# EAGLE design QuadController (EAGLE 6.0)
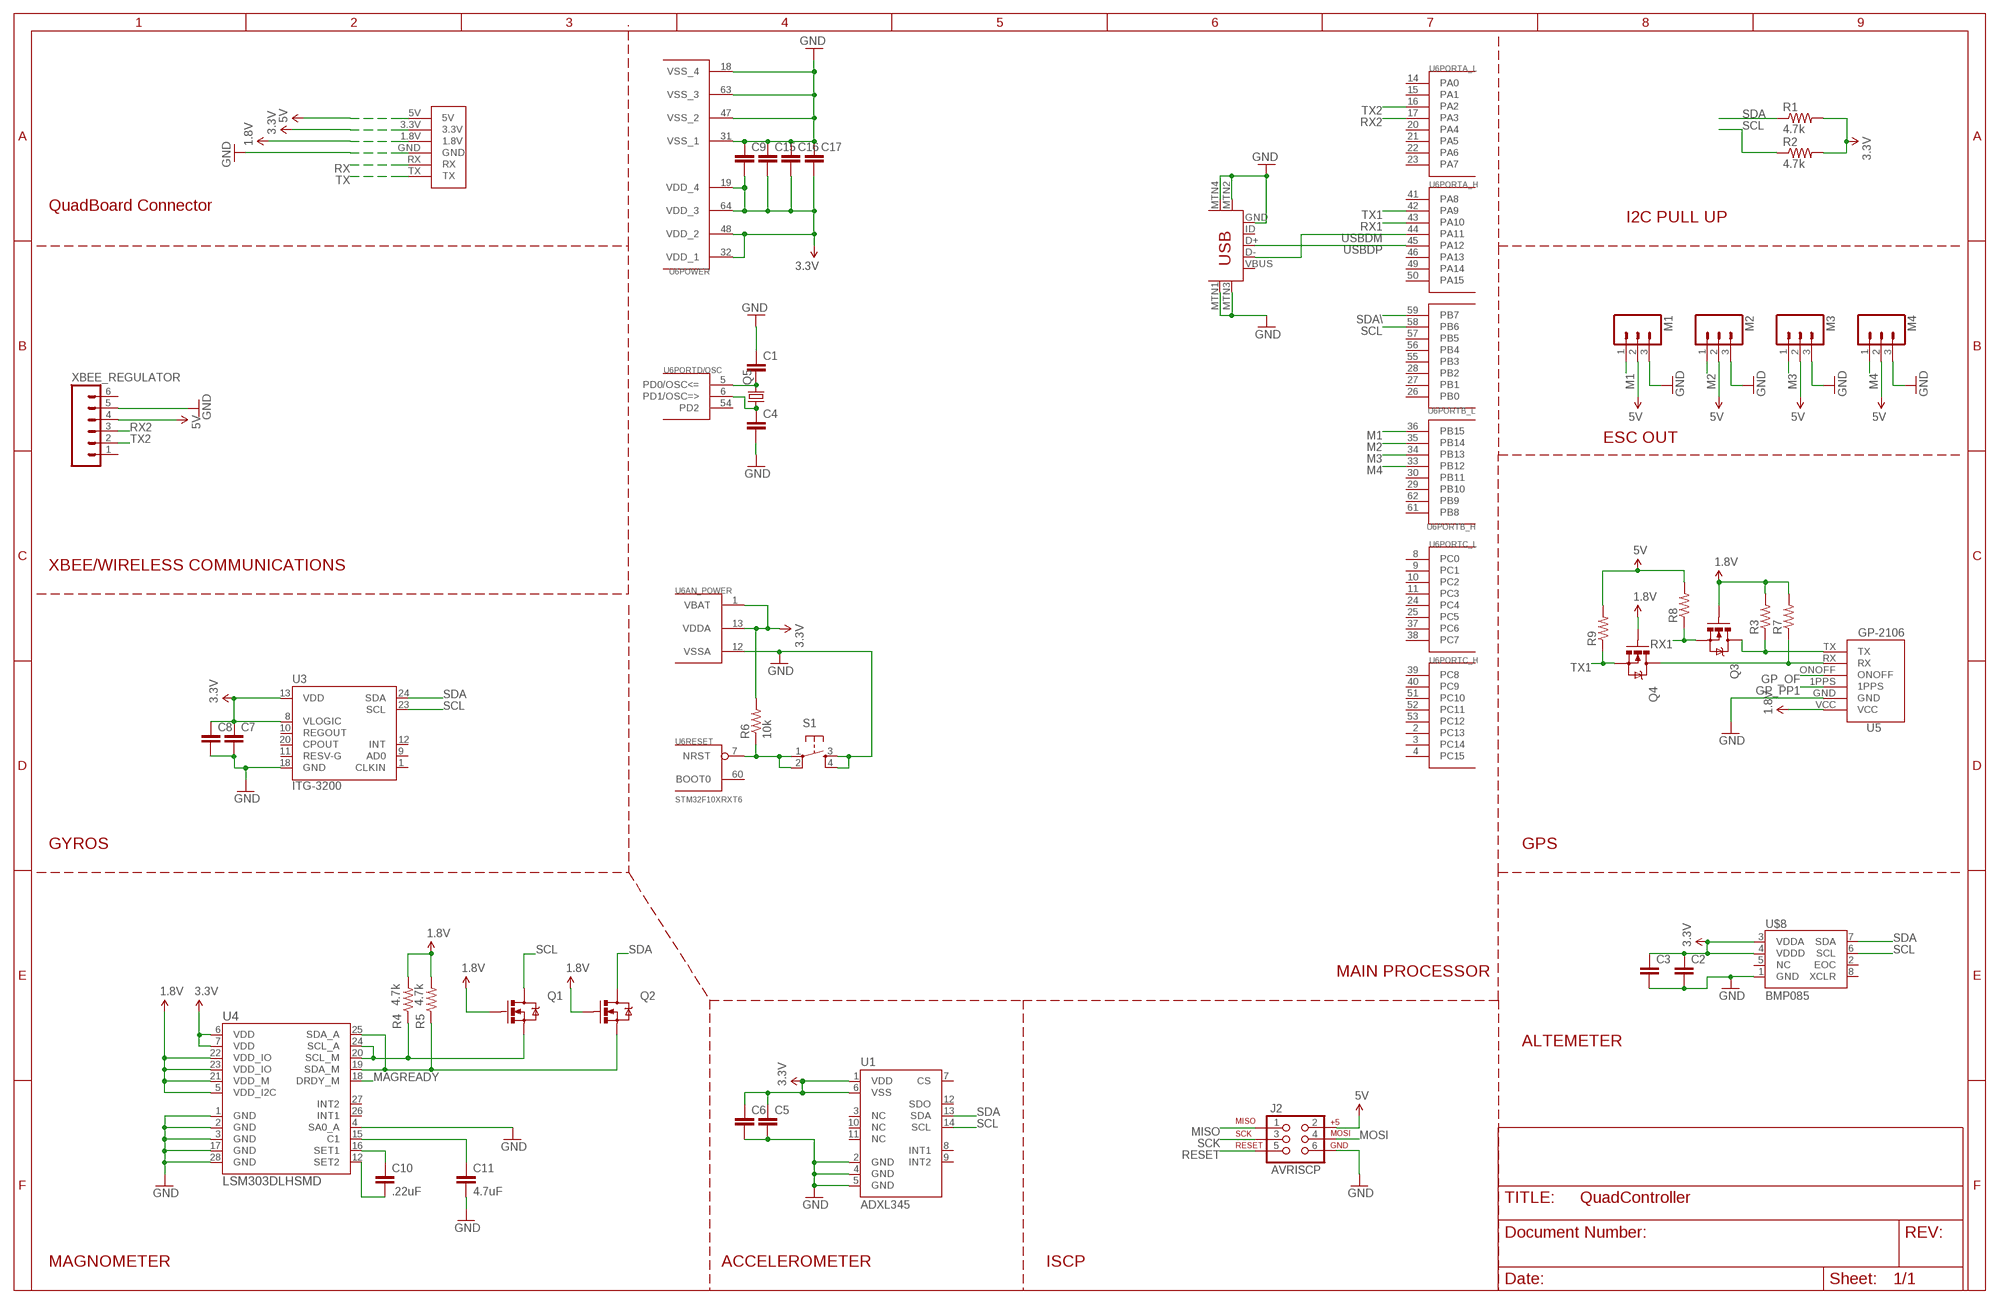
[diagram p0: schematic, sheet 1]

## Parts
C1  CAP0805  [0805]
C2  CAP0805  [0805]
C3  CAP0805  [0805]
C4  CAP0805  [0805]
C5  CAP0805  [0805]
C6  CAP0805  [0805]
C7  CAP0805  [0805]
C8  CAP0805  [0805]
C9  CAP0805  [0805]
C10  .22uF  CAP0805  [0805]
C11  4.7uF  CAP0805  [0805]
C15  CAP0805  [0805]
C16  CAP0805  [0805]
C17  CAP0805  [0805]
J2  AVRISCP  AVR_SPI_PRG_6PTH  [2X3]
M1  M03PTH  [1X03]
M2  M03PTH  [1X03]
M3  M03PTH  [1X03]
M4  M03PTH  [1X03]
Q1  MOSFET-NCHANNELSMD  [SOT23-3]
Q2  MOSFET-NCHANNELSMD  [SOT23-3]
Q3  MOSFET-NCHANNELSMD  [SOT23-3]
Q4  MOSFET-NCHANNELSMD  [SOT23-3]
Q5  CRYSTALHC49UP  [HC49UP]
QB1  QUADBOARD  [QUADBOARD]
R1  4.7k  RESISTOR0805-RES  [0805]
R2  4.7k  RESISTOR0805-RES  [0805]
R3  RESISTOR0805-RES  [0805]
R4  4.7k  RESISTOR0805-RES  [0805]
R5  4.7k  RESISTOR0805-RES  [0805]
R6  10k  RESISTOR0805-RES  [0805]
R7  RESISTOR0805-RES  [0805]
R8  RESISTOR0805-RES  [0805]
R9  RESISTOR0805-RES  [0805]
S1  TAC_SWITCHSMD  [TACTILE_SWITCH_SMD]
U1  ADXL345  [LGA14]
U3  ITG-3200  [QFN-24]
U4  LSM303DLHSMD  [LGA28-5X5]
U5  GP-2106  [GP-2106]
U6  STM32F10XRXT6  [TQFP64]
U$1  USB-MINIB-5PIN  [USB-MINIB]
U$8  BMP085  [BMP085]
XBEE_REGULATOR  M06SIP  [1X06]

## Nets
1.8V: Q1.1(G) Q2.1(G) Q3.1(G) Q4.1(G) QB1.1.8V R3.2 R4.2 R5.2 R7.2 U4.5(VDD_I2C) U4.21(VDD_M) U4.22(VDD_IO) U4.23(VDD_IO) U5.VCC
3.3V: C2.1 C3.1 C5.1 C6.1 C7.1 C8.1 C9.2 C15.2 C16.2 C17.2 QB1.3.3V R1.2 R2.2 R6.2 U1.1(VDD) U1.6(VSS) U3.8(VLOGIC) U3.13(VDD) U4.6(VDD) U4.7(VDD) U6.1(AN_POWER:VBAT) U6.13(AN_POWER:VDDA) U6.19(POWER:VDD_4) U6.32(POWER:VDD_1) U6.48(POWER:VDD_2) U6.64(POWER:VDD_3) U$8.3(VDDA) U$8.4(VDDD)
5V [POWER]: J2.2 M1.2 M2.2 M3.2 M4.2 QB1.5V R8.2 R9.2 XBEE_REGULATOR.4
GND: C1.1 C2.2 C3.2 C4.2 C5.2 C6.2 C7.2 C8.2 C9.1 C11.2 C15.1 C16.1 C17.1 J2.6 M1.3 M2.3 M3.3 M4.3 QB1.GND S1.3 S1.4 U1.2(GND) U1.4(GND) U1.5(GND) U3.18(GND) U4.1(GND) U4.2(GND) U4.3(GND) U4.4(SA0_A) U4.17(GND) U4.28(GND) U5.GND U6.12(AN_POWER:VSSA) U6.18(POWER:VSS_4) U6.31(POWER:VSS_1) U6.47(POWER:VSS_2) U6.63(POWER:VSS_3) U$1.GND U$1.MTN1(MTN2) U$1.MTN2(MTN3) U$1.MTN3(MTN1) U$1.MTN4 U$8.1(GND) XBEE_REGULATOR.5
GP_OF: U5.ONOFF
GP_PP1: U5.1PPS
M1: M1.1 U6.36(PORTB_H:PB15)
M2: M2.1 U6.35(PORTB_H:PB14)
M3: M3.1 U6.34(PORTB_H:PB13)
M4: M4.1 U6.33(PORTB_H:PB12)
MAGREADY: U4.18(DRDY_M)
MISO: J2.1
MOSI: J2.4
N$1: Q2.2(S) R5.1 U4.19(SDA_M) U4.25(SDA_A)
N$2: Q1.2(S) R4.1 U4.20(SCL_M) U4.24(SCL_A)
N$3: C11.1 U4.15(C1)
N$4: C10.1 U4.16(SET1)
N$5: Q3.3(D) R3.1 U5.TX
N$6: Q4.3(D) R7.1 U5.RX
N$7: C10.2 U4.12(SET2)
N$8: R6.1 S1.1 S1.2 U6.7(RESET:NRST)
N$10: C1.2 Q5.2 U6.5(PORTD/OSC:PD0/OSC<=)
N$11: C4.1 Q5.1 U6.6(PORTD/OSC:PD1/OSC=>)
RESET: J2.5
RX: QB1.RX
RX1: Q3.2(S) R8.1 U6.43(PORTA_H:PA10)
RX2: U6.17(PORTA_L:PA3) XBEE_REGULATOR.3
SCK: J2.3
SCL: Q1.3(D) R2.1 U1.14(SCL) U3.23(SCL) U6.58(PORTB_L:PB6) U$8.6(SCL)
SDA: Q2.3(D) R1.1 U1.13(SDA) U3.24(SDA) U$8.7(SDA)
SDA\: U6.59(PORTB_L:PB7)
TX: QB1.TX
TX1: Q4.2(S) R9.1 U6.42(PORTA_H:PA9)
TX2: U6.16(PORTA_L:PA2) XBEE_REGULATOR.2
USBDM: U6.44(PORTA_H:PA11) U$1.D-
USBDP: U6.45(PORTA_H:PA12) U$1.D+
Unconnected: U1.3(NC) U1.7(CS) U1.8(INT1) U1.9(INT2) U1.10(NC) U1.11(NC) U1.12(SDO) U3.1(CLKIN) U3.9(AD0) U3.10(REGOUT) U3.11(RESV-G) U3.12(INT) U3.20(CPOUT) U4.26(INT1) U4.27(INT2) U6.2(PORTC_H:PC13) U6.3(PORTC_H:PC14) U6.4(PORTC_H:PC15) U6.8(PORTC_L:PC0) U6.9(PORTC_L:PC1) U6.10(PORTC_L:PC2) U6.11(PORTC_L:PC3) U6.14(PORTA_L:PA0) U6.15(PORTA_L:PA1) U6.20(PORTA_L:PA4) U6.21(PORTA_L:PA5) U6.22(PORTA_L:PA6) U6.23(PORTA_L:PA7) U6.24(PORTC_L:PC4) U6.25(PORTC_L:PC5) U6.26(PORTB_L:PB0) U6.27(PORTB_L:PB1) U6.28(PORTB_L:PB2) U6.29(PORTB_H:PB10) U6.30(PORTB_H:PB11) U6.37(PORTC_L:PC6) U6.38(PORTC_L:PC7) U6.39(PORTC_H:PC8) U6.40(PORTC_H:PC9) U6.41(PORTA_H:PA8) U6.46(PORTA_H:PA13) U6.49(PORTA_H:PA14) U6.50(PORTA_H:PA15) U6.51(PORTC_H:PC10) U6.52(PORTC_H:PC11) U6.53(PORTC_H:PC12) U6.54(PORTD/OSC:PD2) U6.55(PORTB_L:PB3) U6.56(PORTB_L:PB4) U6.57(PORTB_L:PB5) U6.60(RESET:BOOT0) U6.61(PORTB_H:PB8) U6.62(PORTB_H:PB9) U$1.ID U$1.VBUS U$8.2(EOC) U$8.5(NC) U$8.8(XCLR) XBEE_REGULATOR.1 XBEE_REGULATOR.6

## Notes on the sheet
- QuadBoard Connector
- I2C PULL UP
- ESC OUT
- XBEE/WIRELESS COMMUNICATIONS
- GYROS | GPS
- MAIN PROCESSOR
- ALTEMETER
- MAGNOMETER | ACCELEROMETER | ISCP

## Library data of the parts
C1-C11 C15-C17 = SparkFun:CAP: Capacitor Standard 0603 ceramic capacitor, and 0.1" leaded capacitor.
J2 = SparkFun:AVR_SPI_PRG_6: AVR ISP 6 Pin This is the reduced ISP connector for AVR programming. Common on Arduino. This footprint will take up less PCB space and can be used with a 10-pin to 6-pin adapter such as SKU: BOB-08508
M1-M4 = SparkFun:M03: Header 3 Standard 3-pin 0.1" header. Use with straight break away headers (SKU : PRT-00116), right angle break away headers (PRT-00553), swiss pins (PRT-00743), machine pins (PRT-00117), and female headers (PRT-00115). Molex polarized connector foot print use with SKU : PRT-08232 with associated crimp pins and housings.
Q1-Q4 = SparkFun:MOSFET-NCHANNEL
Q5 = crystal:CRYSTAL: CRYSTAL; OC_FARNELL: unknown; OC_NEWARK: unknown
QB1 = terrys:QUADBOARD
R1-R9 = SparkFun:RESISTOR: Resistor Basic schematic elements and footprints for 0603, 1206, and PTH resistors.
S1 = SparkFun:TAC_SWITCH: Momentary Switch Button commonly used for reset or general input. Spark Fun Electronics SKU : COM-00097
U1 = SparkFun:ADXL345
U3 = SparkFun:ITG-3200: ITG-3200 3-axis gyro, digital output, qfn24 package
U4 = SparkFun:LSM303DLH
U5 = SparkFun:GP-2106: GP-2106 GPS SiRF IV
U6 = stm32:STM32F10XRXT6: STM32F101/103 64pin LQFP
U$1 = SparkFun:USB-MINIB: Mini-USB "B" connector with 5th pin broken out. Created new symbol breaking out 5th "ID" pin in mini/micro USB connector spec. See: http://en.wikipedia.org/wiki/Mini_usb#Cables. Uses same footprint as 4-pin symbol. Also added pins to connect to mounting / shield pads if required (probably not generally needed as signals aren't shielded once they leave the connector).
U$8 = SparkFun:BMP085: BMP085 Pressure Sensor Great little MEMS pressure sensor. SKU: COM-09603
XBEE_REGULATOR = SparkFun:M06: Header 6 Standard 6-pin 0.1" header. Use with straight break away headers (SKU : PRT-00116), right angle break away headers (PRT-00553), swiss pins (PRT-00743), machine pins (PRT-00117), and female headers (PRT-00115). Molex polarized connector foot print use with SKU : PRT-08094 with associated crimp pins and housings. NOTES ON THE VARIANTS LOCK and LOCK_LONGPADS... This footprint was designed to help hold the alignment of a through-hole component (i.e. 6-pin header) while soldering it into place. You may notice that each hole has been shifted either up or down by 0.005 of an inch from it's more standard position (which is a perfectly straight line). This slight alteration caused the pins (the squares in the middle) to touch the edges of the holes. Because they are alternating, it causes a "brace" to hold the component in place. 0.005 has proven to be the perfect amount of "off-center" position when using our standard breakaway headers. Although looks a little odd when you look at the bare footprint, once you have a header in there, the alteration is very hard to notice. Also, if you push a header all the way into place, it is covered up entirely on the bottom side. This idea of altering the position of holes to aid alignment will be further integrated into the Sparkfun Library for other footprints. It can help hold any component with 3 or more connection pins.

## Net classes
0 default: width 0.203 mm, drill 0.406 mm, clearance 0.203 mm
1 POWER: width 0.203 mm, drill 0.406 mm, clearance 0.203 mm

## Board
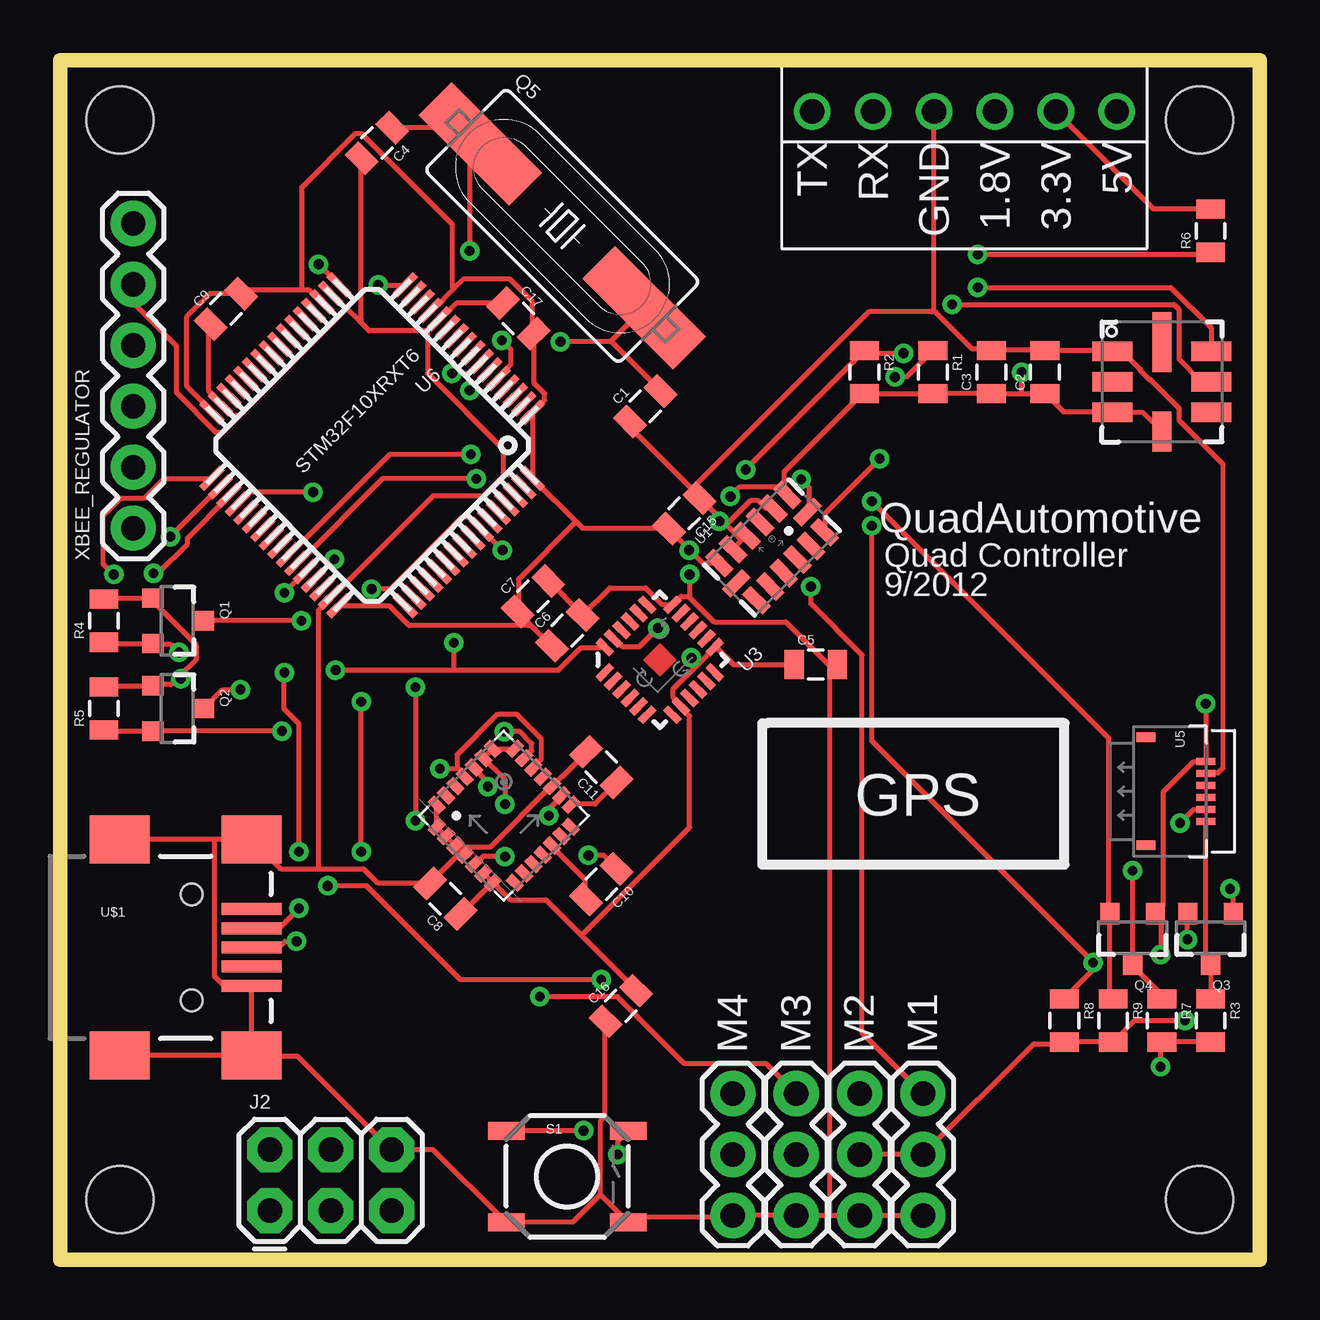
[diagram p1: board, top side]
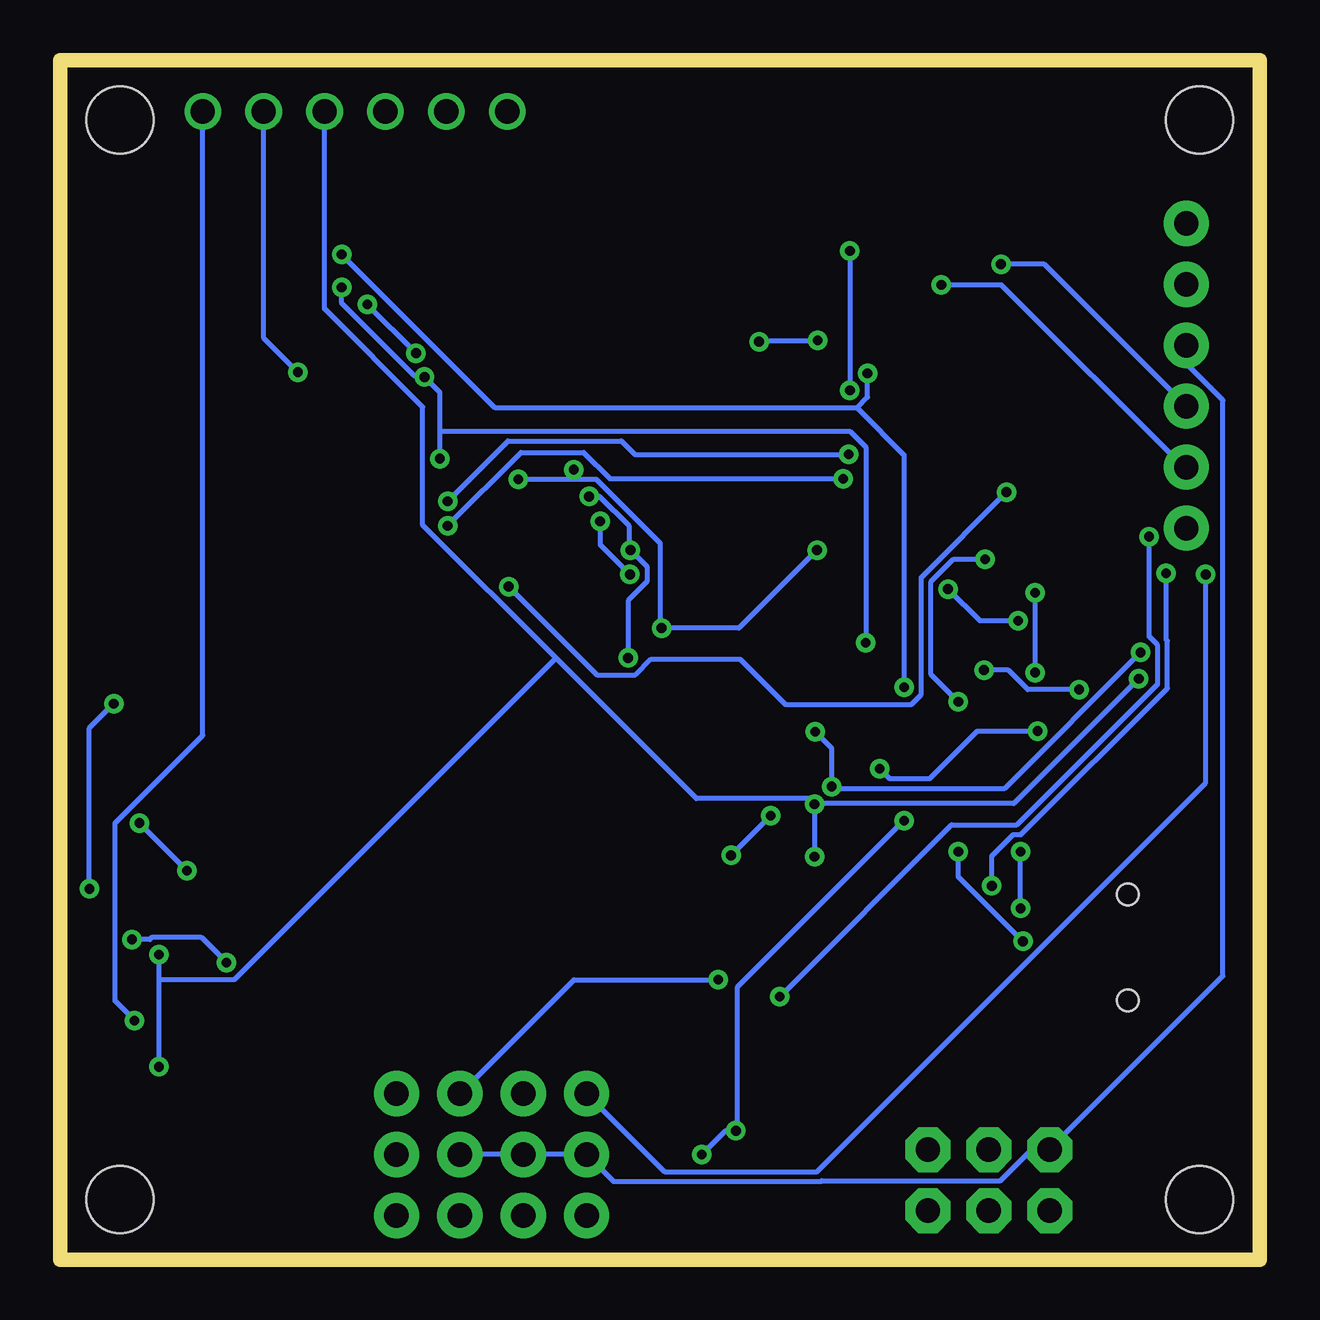
[diagram p2: board, bottom side, seen from below]

Size 50 x 50 mm. Coordinates in mm from the lower left corner, seen from the top.
Copper layers (1*16): Top 0.035mm / dielectric 1.5mm / Bottom 0.035mm
Design rules: minimum track width 8mil, minimum drill 16mil, track to track 8mil, track to pad 8mil, pad to pad 8mil, via to via 8mil, smd to smd 8mil, copper to edge 40mil, drill to drill 8mil, minimum pad ring 10mil, minimum via ring 8mil, stop-mask expansion 4mil, vias tented up to drill 16mil, thermal gap 10mil

### Footprints (pad centres in the part's own frame; a part is rotated, then mirrored left to right if it is on the bottom)
0805 = smd 0.8 x 1.2: 1 -0.9,0; 2 0.9,0
2X3 = drill 1.016 pad 1.88 octagon: 1 0,0; 2 0,2.54; 3 2.54,0; 4 2.54,2.54; 5 5.08,0; 6 5.08,2.54
1X03 = drill 1.016 pad 1.88: 1 0,0; 2 2.54,0; 3 5.08,0
SOT23-3 = smd 0.8 x 0.9: 1 -0.95,-1; 2 0.95,-1; 3 0,1.1
HC49UP = smd 5.334 x 1.93: 1 -4.826,0; 2 4.826,0
QUADBOARD = drill 1.016: 1.8V 13.97,22.86; 3.3V 16.51,22.86; 5V 19.05,22.86; GND 11.43,22.86; RX 8.89,22.86; TX 6.35,22.86 | hole 2.8: -22.5,22.5; 22.5,22.5; 22.5,-22.5; -22.5,-22.5
TACTILE_SWITCH_SMD = smd 1.524 x 0.762: 1 -2.54,1.905; 2 2.54,1.905; 3 -2.54,-1.905; 4 2.54,-1.905
LGA14 = smd 0.5 x 1.2: 1 2,1.1; 2 1.2,1.1; 3 0.4,1.1; 4 -0.4,1.1; 5 -1.2,1.1; 6 -2,1.1; 8 -2,-1.1; 9 -1.2,-1.1; 10 -0.4,-1.1; 11 0.4,-1.1; 12 1.2,-1.1; 13 2,-1.1 | smd 1.2 x 0.5: 7 -2.1,0; 14 2.1,0
QFN-24 = smd 0.8 x 0.3: 1 -2,1.25; 2 -2,0.75; 3 -2,0.25; 4 -2,-0.25; 5 -2,-0.75; 6 -2,-1.25; 13 2,-1.25; 14 2,-0.75; 15 2,-0.25; 16 2,0.25; 17 2,0.75; 18 2,1.25 | smd 0.3 x 0.8: 7 -1.25,-2; 8 -0.75,-2; 9 -0.25,-2; 10 0.25,-2; 11 0.75,-2; 12 1.25,-2; 19 1.25,2; 20 0.75,2; 21 0.25,2; 22 -0.25,2; 23 -0.75,2; 24 -1.25,2
LGA28-5X5 = smd 0.7 x 0.4: 1 -2.3,1.65; 2 -2.3,1.1; 3 -2.3,0.55; 4 -2.3,0; 5 -2.3,-0.55; 6 -2.3,-1.1; 7 -2.3,-1.65; 15 2.3,-1.65; 16 2.3,-1.1; 17 2.3,-0.55; 18 2.3,0; 19 2.3,0.55; 20 2.3,1.1; 21 2.3,1.65 | smd 0.4 x 0.7: 8 -1.65,-2.3; 9 -1.1,-2.3; 10 -0.55,-2.3; 11 0,-2.3; 12 0.55,-2.3; 13 1.1,-2.3; 14 1.65,-2.3; 22 1.65,2.3; 23 1.1,2.3; 24 0.55,2.3; 25 0,2.3; 26 -0.55,2.3; 27 -1.1,2.3; 28 -1.65,2.3
GP-2106 = smd 0.3 x 0.8: 1PPS -0.25,0; GND -0.75,0; ONOFF 0.25,0; RX 0.75,0; TX 1.25,0; VCC -1.25,0 | smd 0.4 x 0.8: P$7 -2.25,-2.5; P$8 2.25,-2.5
TQFP64 = smd 1.2 x 0.3: 1 -5.7,3.75; 2 -5.7,3.25; 3 -5.7,2.75; 4 -5.7,2.25; 5 -5.7,1.75; 6 -5.7,1.25; 7 -5.7,0.75; 8 -5.7,0.25; 9 -5.7,-0.25; 10 -5.7,-0.75; 11 -5.7,-1.25; 12 -5.7,-1.75; 13 -5.7,-2.25; 14 -5.7,-2.75; 15 -5.7,-3.25; 16 -5.7,-3.75; 33 5.7,-3.75; 34 5.7,-3.25; 35 5.7,-2.75; 36 5.7,-2.25; 37 5.7,-1.75; 38 5.7,-1.25; 39 5.7,-0.75; 40 5.7,-0.25; 41 5.7,0.25; 42 5.7,0.75; 43 5.7,1.25; 44 5.7,1.75; 45 5.7,2.25; 46 5.7,2.75; 47 5.7,3.25; 48 5.7,3.75 | smd 0.3 x 1.2: 17 -3.75,-5.7; 18 -3.25,-5.7; 19 -2.75,-5.7; 20 -2.25,-5.7; 21 -1.75,-5.7; 22 -1.25,-5.7; 23 -0.75,-5.7; 24 -0.25,-5.7; 25 0.25,-5.7; 26 0.75,-5.7; 27 1.25,-5.7; 28 1.75,-5.7; 29 2.25,-5.7; 30 2.75,-5.7; 31 3.25,-5.7; 32 3.75,-5.7; 49 3.75,5.7; 50 3.25,5.7; 51 2.75,5.7; 52 2.25,5.7; 53 1.75,5.7; 54 1.25,5.7; 55 0.75,5.7; 56 0.25,5.7; 57 -0.25,5.7; 58 -0.75,5.7; 59 -1.25,5.7; 60 -1.75,5.7; 61 -2.25,5.7; 62 -2.75,5.7; 63 -3.25,5.7; 64 -3.75,5.7
USB-MINIB = smd 2.5 x 0.5: D+ 2.5,0; D- 2.5,0.8; GND 2.5,-1.6; ID 2.5,-0.8; VBUS 2.5,1.6 | smd 2.5 x 2: MTN1 -3,4.5; MTN2 2.5,4.5; MTN3 -3,-4.5; MTN4 2.5,-4.5 | hole 0.9: 0,2.2; 0,-2.2
BMP085 = smd 1.67 x 0.8: 1 -2.065,1.27; 2 -2.065,0; 3 -2.065,-1.27; 5 2.065,-1.27; 6 2.065,0; 7 2.065,1.27 | smd 0.8 x 1.67: 4 0,-2.065 | smd 0.8 x 2.5: 8 0,1.65
1X06 = drill 1.016 pad 1.88: 1 0,0; 2 2.54,0; 3 5.08,0; 4 7.62,0; 5 10.16,0; 6 12.7,0

### Placement (x,y rotation side)
C1  24.39,35.57 45 top
C2  41.05,36.99 90 top
C3  38.82,36.99 90 top
C4  13.21,46.54 225 top
C5  31.5,24.8 0 top
C6  21.14,26.22 45 top
C7  19.72,27.64 45 top
C8  16.06,15.04 135 top
C9  6.92,39.63 45 top
C10  22.56,15.65 225 top
C11  22.56,20.53 135 top
C15  26.02,31.1 225 top
C16  23.37,10.57 45 top
C17  19.11,39.22 315 top
J2  8.74,2.04 0 top
M1  35.97,6.92 270 top
M2  33.33,6.92 270 top
M3  30.69,6.92 270 top
M4  28.05,6.92 270 top
Q1  4.88,26.63 270 top
Q2  4.88,22.97 270 top
Q3  47.96,13.42 180 top
Q4  44.71,13.42 180 top
Q5  20.94,43.08 315 top
QB1  25,25 0 top
R1  36.38,36.99 270 top
R2  33.53,36.99 270 top
R3  47.96,9.96 270 top
R4  1.84,26.63 90 top
R5  1.84,22.97 90 top
R6  47.96,42.88 90 top
R7  45.93,9.96 270 top
R8  41.87,9.96 270 top
R9  43.9,9.96 270 top
S1  21.14,3.46 0 top
U1  29.67,29.67 45 top
U3  25,25 45 top
U4  18.5,18.5 45 top
U5  47.76,19.51 270 top
U6  13.01,33.94 225 top
U$1  5.49,13.01 0 top
U$8  45.93,36.58 0 top
XBEE_REGULATOR  3.05,30.49 90 top

### Tracks (layer width: path | path; a pad name or v marks a point on that pad's centre or on a via)
1.8V  (via drill 0.41)
  Top 0.203: R3.2 R7.2 45.88,8.97 v45.88,8.03 | v45.88,12.71 45.88,14.51 Q4.1 45.68,14.43 45.98,14.74 45.98,19.49 47.25,20.76 U5.VCC v47.76,23.17 | v18.55,16.8 17.63,16.8 17.33,16.49 17.28,16.49 U4.5 | v18.55,18.98 18.55,20.02 U4.23 17.71,20.96 18.01,21.27 U4.22 18.12,21.29 U4.21 | R5.2 1.84,23.88 1.86,23.91 3.87,23.91 Q2.1 3.97,23.96 4.63,23.96 4.95,24.28 | R4.2 1.84,27.54 1.86,27.57 3.87,27.57 Q1.1 3.82,27.49 5.67,25.64 5.67,25 4.95,24.28 | v5.04,24.21 5.01,24.21 4.95,24.28 | Q3.1 48.91,15.31 v48.77,15.45
  Bottom 0.203: v45.88,12.71 45.88,11.67 | 45.88,11.67 v45.88,8.03 | v18.55,18.98 v18.55,16.8 | v5.04,24.21 10.24,19.01 18.47,19.01 v18.55,18.98 | QB1.1.8V 38.97,39.63 34.88,35.54 34.88,30.61 29.33,25.06 | 29.33,25.06 23.48,19.21 18.8,19.21 18.62,19.03 v18.55,18.98 | 45.88,11.67 42.73,11.67 29.33,25.06 | v48.77,15.45 48.77,22.16 v47.76,23.17
3.3V  (via drill 0.41)
  Top 0.203: QB1.3.3V 45.57,43.8 R6.2 | U$8.4 45.14,35.31 U$8.3 43.77,35.34 41.81,35.34 41.13,36.02 C2.1 41.05,36.1 40.09,36.1 | 40.09,36.1 38.89,36.1 C3.1 38.82,36.1 36.38,36.1 R1.2 36.3,36.07 33.61,36.07 R2.2 33.53,36.07 33.43,36.07 30.18,32.82 30.18,32.21 30.31,32.09 30.31,31.88 U1.1 30.11,32.21 28.35,32.21 v27.95,31.81 | 40.09,36.1 v40.09,36.99 | 26.59,24.81 27.29,25.51 U3.13 27.39,25.48 28.07,24.8 C5.1 | 26.59,24.81 25.53,23.76 25.53,23.45 25.86,23.12 25.86,23.07 U3.8 25.94,22.97 26.24,22.66 26.24,18.02 21.74,13.51 | U4.7 18.01,15.73 17.66,16.08 U4.6 | U4.7 17.96,15.65 16.72,14.41 C8.1 | 21.74,13.51 20.25,14.99 18.78,14.99 18.12,15.65 U4.7 | 21.74,13.51 24.01,11.23 C16.2 | 19.58,26.49 20.48,25.58 C6.1 | 19.58,26.49 19.08,26.98 C7.1 19.11,27.11 19.11,28.35 21.51,30.75 | U6.48 11.64,27.24 13.75,27.24 14.56,26.42 19.51,26.42 19.58,26.49 | U6.32 6.31,35.34 6.31,35.39 5.26,36.43 5.26,39.27 6.25,40.27 C9.2 7.65,40.29 7.78,40.42 10.06,40.42 | 10.06,40.42 10.37,40.42 10.85,39.94 10.9,39.94 U6.19 | 26.23,29.58 25.38,30.44 C15.2 25.28,30.49 21.77,30.49 21.51,30.75 | 26.23,29.58 26.78,29.04 27.46,29.04 U1.6 | 16.43,40.48 16.82,40.88 18.75,40.88 19.69,39.94 19.69,38.67 C17.2 19.77,38.56 19.77,36.53 20.2,36.1 20.2,35.82 19.77,35.39 U6.1 U6.64 19.77,32.49 21.51,30.75 | 16.43,40.48 15.53,39.58 15.47,39.58 U6.13 | 10.06,40.42 10.06,44.69 12.3,46.92 12.58,46.92 16.36,43.14 16.36,40.54 16.43,40.48 | v26.32,25.08 26.59,24.81 | v26.22,29.57 26.23,29.58
  Bottom 0.203: QB1.3.3V 41.51,38.41 v40.09,36.99 | v26.32,25.08 26.32,27.46 25.53,28.25 25.53,28.89 v26.22,29.57 26.27,29.65 26.27,30.56 27.51,31.81 v27.95,31.81
5V  (via drill 0.41)
  Top 0.203: v46.89,9.96 44.81,9.96 43.97,9.13 R9.2 R8.2 41.79,9 40.6,9 M1.2 M2.2
  Bottom 0.203: QB1.5V 44.05,21.85 47.71,18.19 47.71,10.78 v46.89,9.96 | XBEE_REGULATOR.4 3.05,37.34 1.53,35.82 1.53,11.82 8.69,4.65 J2.2 9.51,4.58 10.8,3.28 18.24,3.28 18.27,3.26 26.93,3.26 M4.2 M3.2 M2.2
GND  (via drill 0.41)
  Top 0.203: C7.2 20.38,28.28 21.72,26.93 C6.2 22.92,28 24.42,28 25.1,27.31 25.51,27.31 U3.18 25.61,27.36 25.89,27.64 26.19,27.64 | 26.19,27.64 27.26,26.57 30.26,26.57 32.04,24.8 C5.2 32.09,24.72 32.09,1.84 | 28.42,29.99 28.61,30.18 U1.4 | 28.42,29.99 28.05,29.62 U1.5 | 28.42,29.99 27.78,30.63 | 27.78,30.63 27.55,30.85 | 27.55,30.85 26.68,31.73 C15.1 | C1.1 23.76,34.91 23.76,34.7 26.63,31.83 C15.1 | 27.78,30.63 28.81,31.65 29.06,31.65 29.39,31.32 29.72,31.32 U1.2 | U5.GND 48.27,20.28 48.47,20.48 48.47,33.15 46.64,34.98 46.64,35.49 45.47,36.66 45.42,36.66 45.02,37.07 45.02,37.12 44.28,37.85 U$8.1 43.77,37.88 41.13,37.88 C2.2 41.05,37.9 38.82,37.9 C3.2 38.74,37.95 38.03,37.95 36.43,39.55 | 36.43,39.55 QB1.GND | C15.1 26.4,32.19 33.71,39.5 36.35,39.5 36.43,39.55 | v26.24,28.56 26.24,27.72 26.19,27.64 | v27.49,30.77 27.49,30.79 27.55,30.85 | 18.52,32.7 17.66,31.83 15.55,31.83 11.33,27.62 U6.47 11.21,27.54 11.21,27.49 10.78,27.06 10.78,16.29 | 18.52,32.7 18.85,32.7 U6.63 | C9.1 6.18,38.89 6.18,36.23 6.66,35.74 6.66,35.69 U6.31 6.76,35.62 7.19,35.19 7.42,35.19 | C17.1 18.45,39.86 16.52,39.86 15.88,39.22 15.81,39.22 U6.12 15.73,39.15 15.3,38.72 | 12.49,39.11 12.88,38.72 15.3,38.72 | 12.49,39.11 11.96,39.64 | 11.96,39.64 11.33,40.27 U6.18 | C4.2 12.55,45.88 12.55,39.17 12.49,39.11 | 7.42,35.19 7.5,35.19 11.96,39.64 | XBEE_REGULATOR.5 3.05,39.88 4.86,38.08 4.86,36.13 6.51,34.47 6.79,34.47 7.42,35.11 7.42,35.19 | 18.52,32.7 18.47,32.77 18.47,33.79 15.32,36.94 15.32,38.64 15.3,38.72 | U$1.MTN3 U$1.MTN4 | U$1.MTN4 7.98,8.62 U$1.GND 7.88,11.44 6.81,11.44 6.43,11.82 6.43,17.51 | U4.3 16.47,17.28 16.16,17.58 U4.2 16.08,17.66 15.73,18.02 U4.1 15.7,18.12 U4.28
  Top 0.203: U4.3 16.52,17.2 16.85,16.87 U4.4 16.67,16.95 15.42,15.7 C8.2 15.32,15.7 13.24,15.7 12.66,16.29 10.78,16.29 | U4.3 16.64,17.2 17.94,17.2 20.45,19.72 20.5,19.72 U4.17 20.9,20.12 20.94,20.12 21.93,21.11 C11.2 | 6.43,17.51 U$1.MTN2 8.06,17.43 9.2,16.29 10.78,16.29 | 6.43,17.51 U$1.MTN1 | 32.09,1.84 M3.3 M4.3 27.97,1.78 23.58,1.78 S1.4 22.54,2.7 | 32.09,1.84 M2.3 M1.3 | 22.54,2.7 22.54,5.8 22.71,5.98 22.71,9.91 C16.1 | 22.54,2.7 22.46,2.65 21.37,1.56 S1.3 18.52,1.61 15.55,4.58 J2.6 13.75,4.63 9.91,8.46 8.08,8.46 U$1.MTN4
  Bottom 0.203: v26.24,28.56 27.49,29.8 v27.49,30.77
M1  (via drill 0.41)
  Top 0.203: v10.55,31.99 7.93,31.99 7.45,31.5 U6.36 | v31.3,28.05 31.3,27.34 33.43,25.2 33.43,9.46 M1.1
  Bottom 0.203: v10.55,31.99 14.1,28.43 14.1,23.55 14.51,23.15 19.77,23.15 21.65,25.03 25.36,25.03 26.02,24.37 27.62,24.37 v31.3,28.05
M2  (via drill 0.41)
  Top 0.203: v3.89,28.61 4.1,28.61 5.31,29.83 5.31,30.08 7.02,31.78 7.02,31.83 U6.35 | v11.16,15.58 12.78,15.58 16.69,11.67 v22.56,11.67
  Bottom 0.203: v3.89,28.61 3.89,25.84 3.84,25.79 3.84,23.81 9.94,17.71 10.27,17.71 11.16,16.82 v11.16,15.58 | v22.56,11.67 28.58,11.67 M2.1
M3  (via drill 0.41)
  Top 0.203: v4.6,30.13 6.66,32.19 U6.34 | v20,10.95 23.25,10.95 26.04,8.16 29.44,8.16 M3.1
  Bottom 0.203: v4.6,30.13 4.6,25.97 4.25,25.61 4.25,23.98 10.12,18.12 12.83,18.12 v20,10.95
M4  (via drill 0.41)
  Top 0.203: v2.24,28.56 1.81,28.99 1.81,31.02 2.52,31.73 3.54,31.73 4.35,32.54 6.31,32.54 U6.33
  Bottom 0.203: v2.24,28.56 2.24,19.87 18.45,3.66 24.8,3.66 M4.1
N$1  (via drill 0.41)
  Top 0.203: R5.1 1.84,22.05 1.86,22.03 3.87,22.03 Q2.2 3.97,22.03 v9.25,22.03 | 16.54,20.5 16.85,20.2 16.85,20.15 U4.25 | 16.54,20.5 16.54,21.04 18.22,22.71 19.06,22.71 20.07,21.7 20.07,20.86 19.74,20.53 U4.19 | v15.83,20.45 16.47,20.45 16.54,20.5
  Bottom 0.203: v9.25,22.03 11.77,22.03 13.75,20.05 15.42,20.05 v15.83,20.45
N$2  (via drill 0.41)
  Top 0.203: R4.1 1.84,25.71 1.86,25.69 3.87,25.69 Q1.2 3.97,25.64 4.63,25.64 v4.96,25.3 | v17.84,19.72 17.84,19.89 17.28,20.45 17.28,20.5 U4.24 | v18.52,22 19.18,22 19.67,21.52 19.67,21.22 19.36,20.91 U4.20
  Bottom 0.203: v18.52,22 17.84,21.32 v17.84,19.72 17.79,19.64 10.62,19.64 v4.96,25.3
N$3
  Top 0.203: U4.15 21.29,18.98 22.31,18.98 23.2,19.87 C11.1
N$4  (via drill 0.41)
  Top 0.203: v20.38,18.5 20.38,18.78 20.89,19.29 20.89,19.34 U4.16 | v22.03,16.85 22.66,16.85 23.2,16.31 C10.1
  Bottom 0.203: v22.03,16.85 v20.38,18.5
N$5
  Top 0.203: U5.TX 47.76,12.53 Q3.3 R3.1
N$6  (via drill 0.41)
  Top 0.203: v46.69,18.19 47.25,18.75 47.76,18.75 U5.RX | v44.71,16.21 Q4.3 44.74,12.22 45.93,11.03 R7.1
  Bottom 0.203: v44.71,16.21 v46.69,18.19
N$7
  Top 0.203: U4.12 20.53,17.25 20.53,17.2 21.9,15.83 21.9,15.02 C10.2
N$8  (via drill 0.41)
  Top 0.203: v21.82,5.37 S1.1 | v23.25,4.38 23.25,4.93 S1.2 | v16.34,36.94 17.02,36.94 17.51,37.42 17.56,37.42 U6.7 | v38.26,41.89 47.89,41.89 47.96,41.97 R6.1 | v14.81,23.86 v14.81,18.29
  Bottom 0.203: v23.25,4.38 22.26,5.37 v21.82,5.37 21.77,5.44 21.77,11.33 v14.81,18.29 | v16.34,36.94 16.34,35.95 16.77,35.52 | 16.77,35.52 31.88,35.52 v38.26,41.89 | v14.81,23.86 14.81,33.53 16.72,35.44 16.77,35.52
N$10  (via drill 0.41)
  Top 0.203: v18.42,38.31 18.78,37.95 18.78,37.29 18.29,36.81 18.29,36.73 U6.5 | 22.94,38.26 v20.86,38.26 | 22.94,38.26 24.34,39.66 Q5.2 | C1.2 25.03,36.23 23.02,38.23 22.94,38.26
  Bottom 0.203: v18.42,38.31 20.81,38.31 v20.86,38.26
N$11  (via drill 0.41)
  Top 0.203: v17.08,36.23 17.91,37.07 U6.6 | v17.08,42.04 17.08,46.06 17.51,46.49 Q5.1 17,46.11 15.93,47.17 13.87,47.17 C4.1
  Bottom 0.203: v17.08,42.04 v17.08,36.23
RX1  (via drill 0.41)
  Top 0.203: v47,13.34 47,14.41 Q3.2 | R8.1 41.87,10.88 43.06,12.07 v43.06,12.38 43.01,12.45 33.84,21.62 v33.84,30.59 | v17.35,32.54 13.44,32.54 9.94,29.04 9.89,29.04 U6.43
  Bottom 0.203: v47,13.34 46.26,13.34 46.18,13.42 44.1,13.42 v43.06,12.38 | v17.35,32.54 27.08,32.54 28.17,33.64 30.79,33.64 v33.84,30.59
RX2  (via drill 0.41)
  Top 0.203: v10.78,41.48 11.61,40.65 U6.17
  Bottom 0.203: v10.78,41.48 8.97,41.48 XBEE_REGULATOR.3
SCL  (via drill 0.41)
  Top 0.203: v24.92,26.32 24.14,25.53 23.45,25.53 23.12,25.86 23.07,25.86 U3.23 | v18.45,29.57 17.58,30.44 U6.58 17.48,30.49 17.02,30.94 16.77,30.94 13.77,27.95 v12.99,27.95 | v10.06,26.63 Q1.3 | v30.89,32.52 31.22,32.19 31.22,31.48 31.17,31.43 31.17,31.17 U1.14 | v28.58,32.92 R2.1 33.56,37.78 v35.16,37.78 | U$8.6 47.58,36.58 46.64,37.52 46.64,39.61 46.44,39.81 v37.19,39.81
  Bottom 0.203: v18.45,29.57 21.7,26.32 v24.92,26.32 24.97,26.4 24.97,29.85 27.64,32.52 28.58,32.52 | v10.06,26.63 11.66,26.63 v12.99,27.95 | 28.58,32.52 v30.89,32.52 | 28.58,32.52 v28.58,32.92 | v35.16,37.78 v37.19,39.81
SDA  (via drill 0.41)
  Top 0.203: v11.49,24.57 16.41,24.57 | 16.41,24.57 20.78,24.57 21.72,25.51 22.69,25.51 U3.24 | v7.52,23.76 6.79,23.76 6,22.97 Q2.3 | v34.17,33.38 31.88,31.1 31.88,30.33 U1.13 | v34.8,36.79 35.29,36.79 R1.1 | v38.26,40.52 46.31,40.52 47.99,38.84 U$8.7 | v16.41,25.71 16.41,24.57
  Bottom 0.203: v11.49,24.57 10.47,24.57 9.66,23.76 v7.52,23.76 | 34.17,34.53 34.17,36.15 v34.8,36.79 34.88,36.84 35.24,36.84 38.26,39.86 v38.26,40.52 | 34.17,34.53 v34.17,33.38 | v16.41,25.71 16.41,33.86 17.08,34.53 34.17,34.53
TX1  (via drill 0.41)
  Top 0.203: R9.1 43.9,10.88 43.77,11 Q4.2 43.72,14.51 43.72,21.72 v33.84,31.6 | v17.13,33.56 13.75,33.56 9.58,29.39 9.53,29.39 U6.42
  Bottom 0.203: v17.13,33.56 26.04,33.56 26.6,34.12 31.32,34.12 v33.84,31.6
TX2  (via drill 0.41)
  Top 0.203: v13.27,40.62 U6.16
  Bottom 0.203: v13.27,40.62 10.75,40.62 3.16,33.03 XBEE_REGULATOR.2
USBDM  (via drill 0.41)
  Top 0.203: v9.35,27.79 10.22,28.66 U6.44 | v9.35,24.47 9.35,22.94 9.96,22.33 v9.96,17 | v9.96,14.64 9.15,13.82 8.01,13.82 U$1.D-
  Bottom 0.203: v9.35,24.47 v9.35,27.79 | v9.96,14.64 v9.96,17
USBDP  (via drill 0.41)
  Top 0.203: v11.44,29.19 10.57,28.33 U6.45 | v12.55,17 v12.55,23.25 | v9.86,13.27 9.38,13.27 9.12,13.01 U$1.D+
  Bottom 0.203: v11.44,29.19 12.76,29.19 13.7,28.25 13.7,24.39 v12.55,23.25 | v12.55,17 12.55,15.96 v9.86,13.27

### Text on the board
tPlace: QuadAutomotive | Quad Controller | 9/2012 | GPS